# Altium schematic sheet Supply.SchDoc
size A4; SheetNumber: 1; SheetTotal: 3
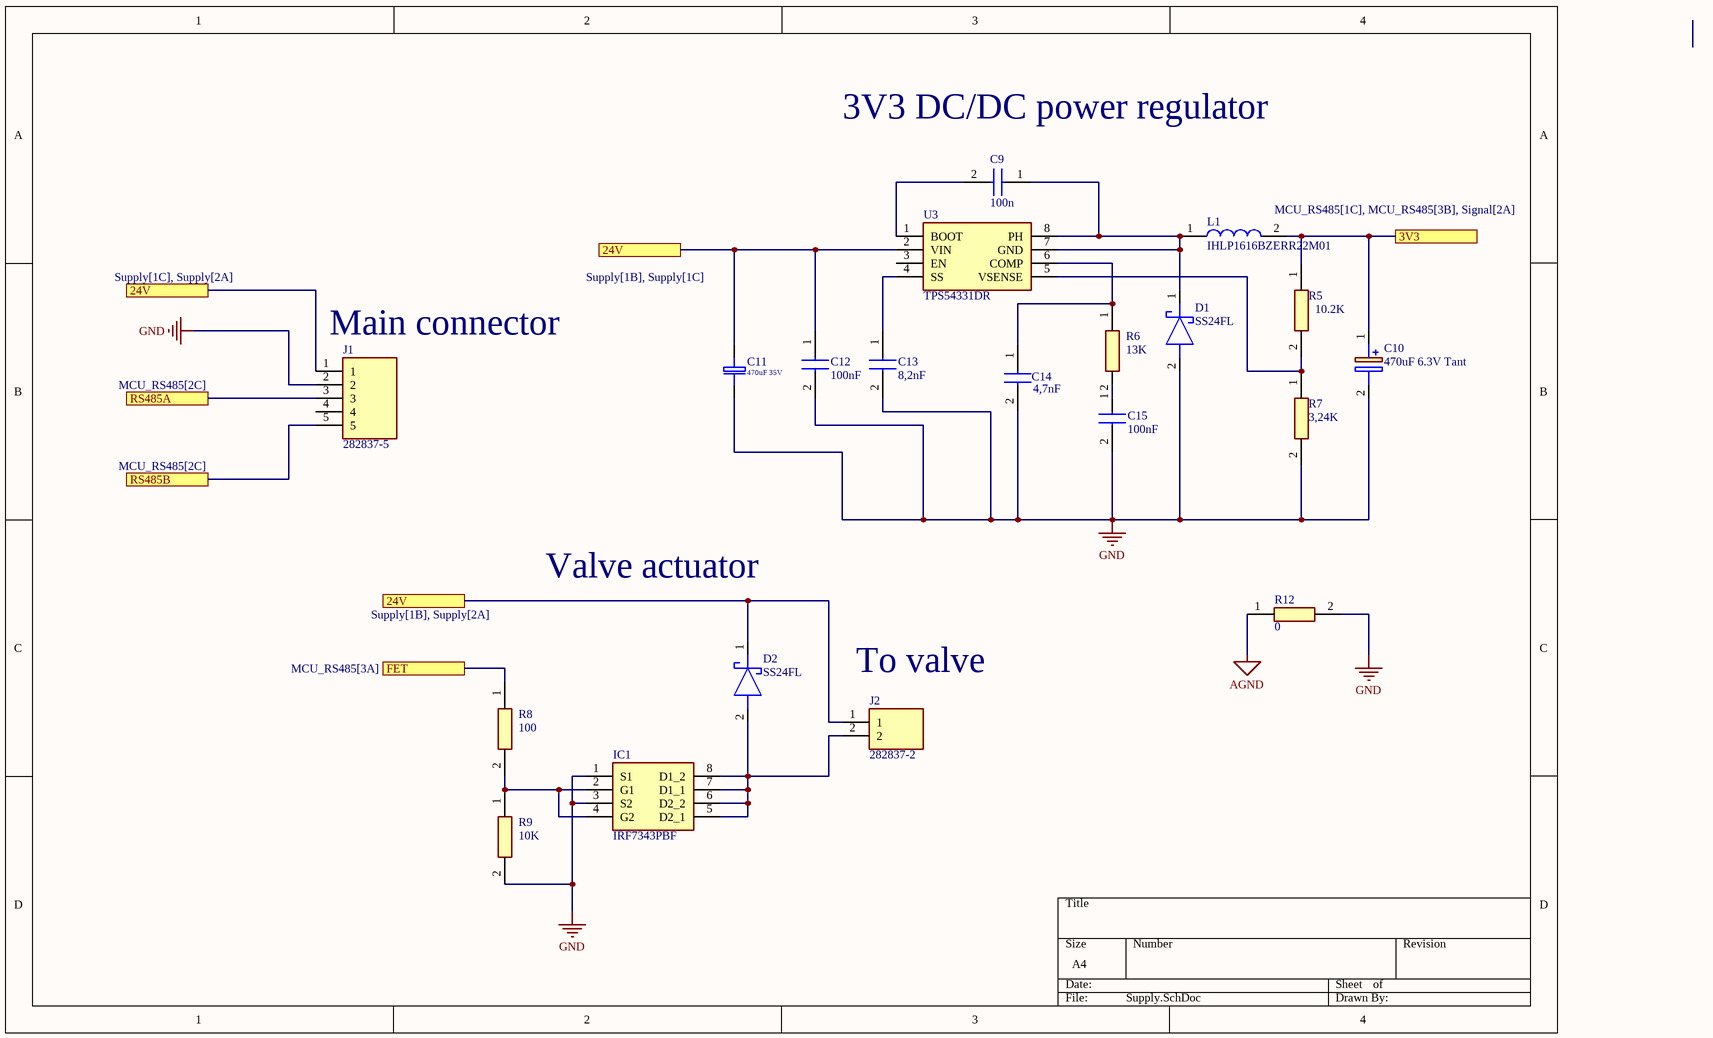
[diagram p0: Supply.SchDoc]

## Parts
C9  100n  [CAPC2012X94N]
C10  470uF 6.3V Tant  [CAPPM6032X280N]
C11  470uF 35V  [El-d8-h12-F3.81]
C12  100nF  [CAPC2012X94N]
C13  8,2nF  [CAPC2012X94N]
C14  4,7nF  [CAPC2012X94N]
C15  100nF  [CAPC2012X94N]
D1  SS24FL  [SODFL3617X108N]
D2  SS24FL  [SODFL3617X108N]
IC1  IRF7343PBF  [SOIC127P600X175-8N]
J1  282837-5  [2828375]
J2  282837-2  [2828372]
L1  IHLP1616BZERR22M01  [INDPM4441X200N]
R5  10.2K  [RESC2012X65N]
R6  13K  [RESC2012X65N]
R7  3,24K  [RESC2012X65N]
R8  100  [RESC2012X65N]
R9  10K  [RESC2012X65N]
R12  0  [RESC2012X65N]
U3  TPS54331DR  [SOIC127P600X175-8N]

## Ports
3V3 (see MCU_RS485[1C], MCU_RS485[3B], Signal[2A]), 24V (see Supply[1B], Supply[1C]), 24V (see Supply[1B], Supply[2A]), 24V (see Supply[1C], Supply[2A]), FET (see MCU_RS485[3A]), RS485A (see MCU_RS485[2C]), RS485B (see MCU_RS485[2C])

## Nets
AGND: R12.1
GND: C10.2(-) C11.2 C12.2 C13.2 C14.2 C15.2 D1.2(A) IC1.1(S1) IC1.3(S2) J1.2 R7.2 R9.2 R12.2
3V3: C10.1(+) L1.2 R5.1 ; port 3V3
24V: C11.1 C12.1 D2.1(K) J1.1 J2.1 U3.2(VIN) ; port 24V
FET: R8.1 ; port FET
RS485A: J1.3 ; port RS485A
RS485B: J1.5 ; port RS485B
NetC9_1: C9.1 D1.1(K) L1.1 U3.7(GND) U3.8(PH)
NetC9_2: C9.2 U3.1(BOOT)
NetC13_1: C13.1 U3.4(SS)
NetC14_1: C14.1 R6.1 U3.6(COMP)
NetC15_1: C15.1 R6.2
NetD2_2: D2.2(A) IC1.5(D2_1) IC1.6(D2_2) IC1.7(D1_1) IC1.8(D1_2) J2.2
NetIC1_2: IC1.2(G1) IC1.4(G2) R8.2 R9.1
NetR5_2: R5.2 R7.1 U3.5(VSENSE)

Not connected (* = marked no-connect by the designer): J1 4; U3 3(EN)

## Notes on the sheet
- 3V3 DC/DC power regulator
- (near J1) Main connector
- Valve actuator
- (near J2) To valve

## Library data of the parts
C9 C12-C15 = 08055A471FAT4A: Capacitor; Manufacturer_Name: AVX; Datasheet Link: https://componentsearchengine.com/Datasheets/1/06031A100FAT2A.pdf; Height: 0.94mm; Manufacturer_Part_Number: 08055A471FAT4A; Mouser Part Number: 581-08055A471FAT4A; Mouser Price/Stock: https://www.mouser.com/Search/Refine.aspx?Keyword=581-08055A471FAT4A; Arrow Part Number: 08055A471FAT4A; Arrow Price/Stock: https://www.arrow.com/en/products/08055a471fat4a/avx
C10 = TAJC477K004RNJ: Capacitor Polarised; Manufacturer_Name: AVX; Datasheet Link: http://datasheets.avx.com/TAJ.pdf; Height: 2.8mm; Manufacturer_Part_Number: TAJC477K004RNJ; Mouser Part Number: 581-TAJC477K004RNJ; Mouser Price/Stock: https://www.mouser.com/Search/Refine.aspx?Keyword=581-TAJC477K004RNJ; Arrow Part Number: TAJC477K004RNJ; Arrow Price/Stock: https://www.arrow.com/en/products/tajc477k004rnj/avx
C11 = 100u-35V-105F: 35V-105F 0.5om 0.4A; Price: 0.07; Value: 470uF 35V
D1 D2 = SS24FL: Schottky Diode; Manufacturer_Name: onsemi; Datasheet Link: https://www.onsemi.com/pub/Collateral/SS26FL-D.PDF; Height: 1.08mm; Manufacturer_Part_Number: SS24FL; Mouser Part Number: 512-SS24FL; Mouser Price/Stock: https://www.mouser.co.uk/ProductDetail/onsemi-Fairchild/SS24FL?qs=tqW9UTzndZyvT5hdH%252BfSxg%3D%3D; Arrow Part Number: SS24FL; Arrow Price/Stock: https://www.arrow.com/en/products/ss24fl/on-semiconductor?region=europe
IC1 = IRF7343PBF: Integrated Circuit; Manufacturer_Name: Infineon; Datasheet Link: https://www.infineon.com/dgdl/irf7343pbf.pdf?fileId=5546d462533600a4015355f68c1a1b73; Height: 1.75mm; Manufacturer_Part_Number: IRF7343PBF; Mouser Part Number: 942-IRF7343PBF; Mouser Price/Stock: https://www.mouser.co.uk/ProductDetail/Infineon-IR/IRF7343PBF?qs=oV44URRYgr3BtQItr9FXKw%3D%3D; Arrow Part Number: IRF7343PBF; Arrow Price/Stock: https://www.arrow.com/en/products/irf7343pbf/infineon-technologies-ag
J1 = 282837-5: Connector; Manufacturer_Name: TE Connectivity; Datasheet Link: https://www.te.com/commerce/DocumentDelivery/DDEController?Action=srchrtrv&DocNm=282837&DocType=Customer+Drawing&DocLang=English; Height: 10.3mm; Manufacturer_Part_Number: 282837-5; Mouser Part Number: 571-2828375; Mouser Price/Stock: https://www.mouser.co.uk/ProductDetail/TE-Connectivity/282837-5?qs=A%252Bip%252BNCYi6MoalTIA9eyLA%3D%3D; Arrow Part Number: 282837-5; Arrow Price/Stock: https://www.arrow.com/en/products/282837-5/te-connectivity?region=nac
J2 = 282837-2: Connector; Manufacturer_Name: TE Connectivity; Datasheet Link: https://www.te.com/commerce/DocumentDelivery/DDEController?Action=srchrtrv&DocNm=282837&DocType=Customer+Drawing&DocLang=English&DocFormat=pdf&PartCntxt=282837-2; Height: 10.3mm; Manufacturer_Part_Number: 282837-2; Mouser Part Number: 571-2828372; Mouser Price/Stock: https://www.mouser.co.uk/ProductDetail/TE-Connectivity/282837-2?qs=A%252Bip%252BNCYi6O2H0NGWOeAxg%3D%3D; Arrow Part Number: 282837-2; Arrow Price/Stock: https://www.arrow.com/en/products/282837-2/te-connectivity?region=europe
L1 = IHLP1616BZERR22M01: Inductor; Manufacturer_Name: Vishay; Datasheet Link: https://datasheet.datasheetarchive.com/originals/distributors/Datasheets-DGA11/2193884.pdf; Height: 2mm; Manufacturer_Part_Number: IHLP1616BZERR22M01; Mouser Part Number: 70-IHLP1616BZERR22M0; Mouser Price/Stock: https://www.mouser.co.uk/ProductDetail/Vishay-Dale/IHLP1616BZERR22M01?qs=UUKq9QDXQ0nvzHiHJuJb2g%3D%3D; Arrow Part Number: IHLP1616BZERR22M01; Arrow Price/Stock: https://www.arrow.com/en/products/ihlp1616bzerr22m01/vishay
R5-R9 R12 = CPF0805B102KE1: Resistor; Manufacturer_Name: TE Connectivity; Datasheet Link: http://docs-europe.electrocomponents.com/webdocs/13d1/0900766b813d116f.pdf; Height: 0.65mm; Manufacturer_Part_Number: CPF0805B102KE1; Mouser Part Number: 279-CPF0805B102KE1; Mouser Price/Stock: https://www.mouser.com/Search/Refine.aspx?Keyword=279-CPF0805B102KE1
U3 = TPS54331D: Integrated Circuit; Manufacturer_Name: Texas Instruments; Datasheet Link: http://www.ti.com/lit/gpn/tps54331; Height: 1.75mm; Manufacturer_Part_Number: TPS54331D; Mouser Part Number: 595-TPS54331D; Mouser Price/Stock: https://www.mouser.co.uk/ProductDetail/Texas-Instruments/TPS54331D?qs=QyYHynRG50pEbpiybdzwkw%3D%3D; Arrow Part Number: TPS54331D; Arrow Price/Stock: https://www.arrow.com/en/products/tps54331d/texas-instruments?region=nac